# Altium schematic sheet MCU042A_Engine.SchDoc: Engine
size 558 x 431 mm; Date: Not shown in title block; ApprovedBy: Not shown in title block; CheckedBy: Not shown in title block; Author: Not shown in title block; CompanyName: Not shown in title block; DrawnBy: Vince Rodriguez; Engineer: Not shown in title block; Organization: Not shown in title block; Address1: Not shown in title block; Address2: Not shown in title block; Address3: Not shown in title block; Address4: Not shown in title block; DocumentNumber: 2; Revision: Use project parameter SCH_Rev; SheetNumber: 2; SheetTotal: 5; PageSetup: Record=PageOptions|CenterHorizontal=True|CenterVertical=True|PrintScale=1.00|XCorrection=1.00|YCorrection=1.00|PrintKind=0|BorderSize=5000000|LeftOffset=0|BottomOffset=0|Orientation=2|PaperLength=1000|PaperWidth=1000|Scale=100|PaperSource=15|PrintQuality=600|MediaType=1|DitherType=10|PaperKind=Letter|PrintScaleMode=1; CurrentTime: Not shown in title block; CurrentDate: Not shown in title block; Time: Not shown in title block; DocumentFullPathAndName: Not shown in title block; DocumentName: Not shown in title block; ModifiedDate: Not shown in title block; ImagePath: Not shown in title block
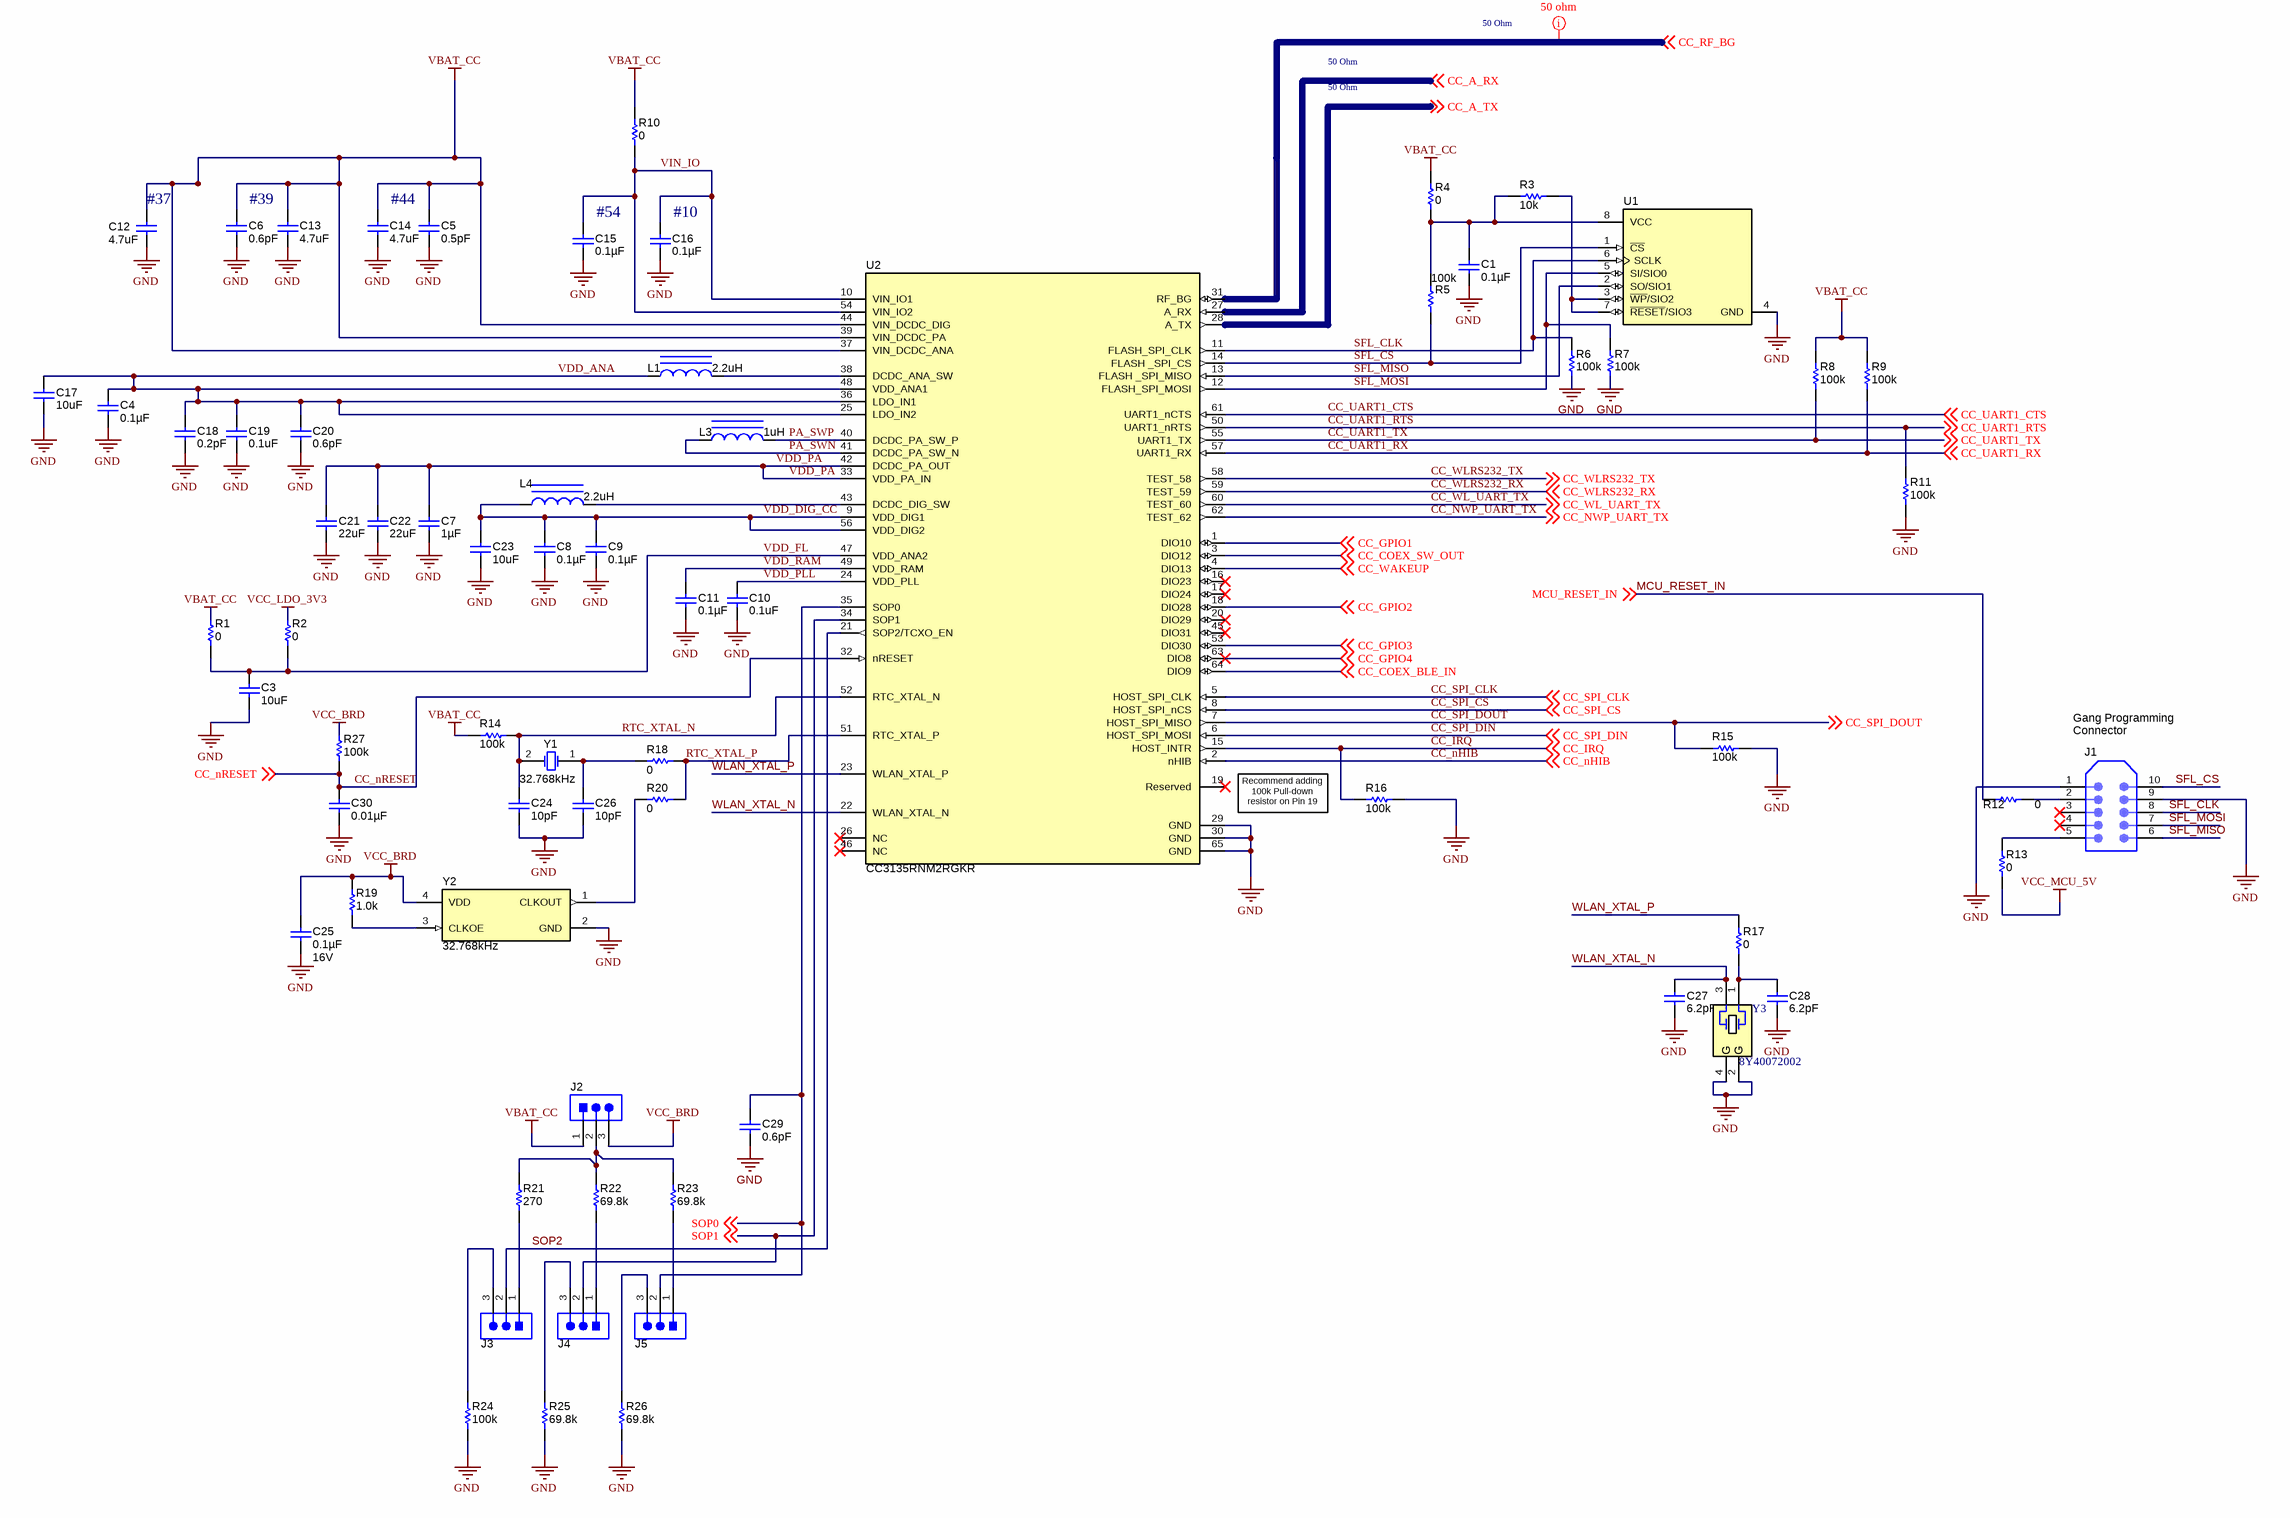
[diagram p0: MCU042A_Engine.SchDoc]

## Parts
C1  ValueDisplayed: 0.1µF  [0402]  (hidden comment: CL05B104KO5NNNC)
C3  ValueDisplayed: 10uF  [0603]  (hidden comment: CMP-0007303-5)
C4  ValueDisplayed: 0.1µF  [0402]  (hidden comment: CL05B104KO5NNNC)
C5  ValueDisplayed: 0.5pF  [0201_033]  (hidden comment: GJM0335C1ER50BB01D)
C6  ValueDisplayed: 0.6pF  [0201_033]  (hidden comment: GJM0335C1ER60BB01D)
C7  ValueDisplayed: 1µF  [0402]  (hidden comment: CL05A105MP5NNNC)
C8  ValueDisplayed: 0.1µF  [0402S]  (hidden comment: CL05B104KO5NNNC)
C9  ValueDisplayed: 0.1µF  [0402S]  (hidden comment: CL05B104KO5NNNC)
C10  ValueDisplayed: 0.1uF  [0201]  (hidden comment: CMP-0009655-3)
C11  ValueDisplayed: 0.1µF  [0402S]  (hidden comment: CL05B104KO5NNNC)
C12  ValueDisplayed: 4.7uF  [0402]  (hidden comment: CMP-0064972-2)
C13  ValueDisplayed: 4.7uF  [0402]  (hidden comment: CMP-0064972-2)
C14  ValueDisplayed: 4.7uF  [0402]  (hidden comment: CMP-0064972-2)
C15  ValueDisplayed: 0.1µF  [0402S]  (hidden comment: CL05B104KO5NNNC)
C16  ValueDisplayed: 0.1µF  [0402S]  (hidden comment: CL05B104KO5NNNC)
C17  ValueDisplayed: 10uF  [0603]  (hidden comment: CMP-0064953-4)
C18  ValueDisplayed: 0.2pF  [0201_033]  (hidden comment: GJM0335C1ER20BB01D)
C19  ValueDisplayed: 0.1uF  [0201]  (hidden comment: CL03A104KP3NNNC)
C20  ValueDisplayed: 0.6pF  [0201_033]  (hidden comment: GJM0335C1ER60BB01D)
C21  ValueDisplayed: 22uF  [0603]  (hidden comment: CMP-0064952-4)
C22  ValueDisplayed: 22uF  [0603]  (hidden comment: CMP-0064952-4)
C23  ValueDisplayed: 10uF  [0603]  (hidden comment: CMP-0064953-4)
C24  ValueDisplayed: 10pF  [0402]  (hidden comment: 0402N100J500CT)
C25  ValueDisplayed: 0.1µF  VDC_V: 16V  [0402]  (hidden comment: CL05B104KO5NNNC)
C26  ValueDisplayed: 10pF  [0402]  (hidden comment: 0402N100J500CT)
C27  ValueDisplayed: 6.2pF  [0402]  (hidden comment: 0402N6R2C500CT)
C28  ValueDisplayed: 6.2pF  [0402]  (hidden comment: 0402N6R2C500CT)
C29  ValueDisplayed: 0.6pF  [0201_033]  (hidden comment: GJM0335C1ER60BB01D)
C30  ValueDisplayed: 0.01µF  [0402]  (hidden comment: 0402B103K500CT)
J1  TC2050-IDC-NL-FP  [Tag_TC2050-NL]  (value not drawn)  (no BOM)
J2  CMP-0054796-1  [WURTH_61300311121]  (value not drawn)
J3  CMP-0054796-1  [WURTH_61300311121]  (value not drawn)
J4  CMP-0054796-1  [WURTH_61300311121]  (value not drawn)
J5  CMP-0054796-1  [WURTH_61300311121]  (value not drawn)
L1  ValueDisplayed: 2.2uH  [LQM2MPN_G0]  (hidden comment: CMP-0058761-1)
L3  ValueDisplayed: 1uH  [1008]  (hidden comment: CMP-0058750-1)
L4  ValueDisplayed: 2.2uH  [LQM2MPN_G0]  (hidden comment: CMP-0058761-1)
R1  ValueDisplayed: 0  [0603]  (hidden comment: CMP-0025885-3)
R2  ValueDisplayed: 0  [0603]  (hidden comment: CMP-0025885-3)
R3  ValueDisplayed: 10k  [0402]  (hidden comment: CMP-0026825-5)
R4  ValueDisplayed: 0  [0603]  (hidden comment: CMP-0025885-3)
R5  ValueDisplayed: 100k  [0402]  (hidden comment: CMP-0026823-3)
R6  ValueDisplayed: 100k  [0402S]  (hidden comment: CMP-0026823-3)
R7  ValueDisplayed: 100k  [0402S]  (hidden comment: CMP-0026823-3)
R8  ValueDisplayed: 100k  [0402]  (hidden comment: CMP-0026823-3)
R9  ValueDisplayed: 100k  [0402]  (hidden comment: CMP-0026823-3)
R10  ValueDisplayed: 0  [0603]  (hidden comment: CMP-0025885-3)
R11  ValueDisplayed: 100k  [0402]  (hidden comment: CMP-0026823-3)
R12  ValueDisplayed: 0  [0402]  (hidden comment: CMP-0026992-2)
R13  ValueDisplayed: 0  [0402]  (hidden comment: CMP-0026992-2)
R14  ValueDisplayed: 100k  [0402]  (hidden comment: CMP-0026823-3)
R15  ValueDisplayed: 100k  [0402]  (hidden comment: CMP-0026823-3)
R16  ValueDisplayed: 100k  [0402]  (hidden comment: CMP-0026823-3)
R17  ValueDisplayed: 0  [0402]  (hidden comment: CMP-0026992-2)
R18  ValueDisplayed: 0  [0402]  (hidden comment: CMP-0026992-2)
R19  ValueDisplayed: 1.0k  [0402]  (hidden comment: CMP-0026852-3)
R20  ValueDisplayed: 0  [0402]  (hidden comment: CMP-0026992-2)
R21  ValueDisplayed: 270  [0402]  (hidden comment: CMP-0026886-3)
R22  ValueDisplayed: 69.8k  [0402]  (hidden comment: CMP-0026510-2)
R23  ValueDisplayed: 69.8k  [0402]  (hidden comment: CMP-0026510-2)
R24  ValueDisplayed: 100k  [0402]  (hidden comment: CMP-0026823-3)
R25  ValueDisplayed: 69.8k  [0402]  (hidden comment: CMP-0026510-2)
R26  ValueDisplayed: 69.8k  [0402]  (hidden comment: CMP-0026510-2)
R27  ValueDisplayed: 100k  [0402]  (hidden comment: CMP-0026823-3)
U1  CMP-0004904-1  [SOP-8_150MIL]  (value not drawn)
U2  CC3135RNM2RGKR  [RGK0064B]
Y1  Frequency_Fixed: 32.768kHz  [XTAL_ABS07]  (hidden comment: CMP-0004575-3)
Y2  Frequency_Fixed: 32.768kHz  [MC_OV-7604-C7]  (hidden comment: CMP-0004716-3)
Y3  8Y40072002  [TXC_8Y]

## Nets
GND: C1.2 C3.2 C4.2 C5.2 C6.2 C7.2 C8.2 C9.2 C10.2 C11.2 C12.2 C13.2 C14.2 C15.2 C16.2 C17.2 C18.2 C19.2 C20.2 C21.2 C22.2 C23.2 C24.2 C25.2 C26.2 C27.2 C28.2 C29.2 C30.2 J1.1 J1.9 R6.1 R7.1 R11.2 R15.2 R16.2 R24.2 R25.2 R26.2 U1.4(GND) U2.29(GND) U2.30(GND) U2.65(GND) Y2.2(GND) Y3.2(GND) Y3.4(GND)
VBAT_CC: C5.1 C6.1 C12.1 C13.1 C14.1 J2.1 R1.2 R4.2 R8.1 R9.1 R10.2 R14.1 U2.37(VIN_DCDC_ANA) U2.39(VIN_DCDC_PA) U2.44(VIN_DCDC_DIG)
VCC_BRD: C25.1 J2.3 R19.1 R27.1 Y2.4(VDD)
VCC_LDO_3V3: R2.2
VCC_MCU_5V: R13.1
CC_A_RX: U2.27(A_RX) ; off-sheet CC_A_RX
CC_A_TX: U2.28(A_TX) ; off-sheet CC_A_TX
CC_COEX_BLE_IN: U2.64(DIO9) ; off-sheet CC_COEX_BLE_IN
CC_COEX_SW_OUT: U2.3(DIO12) ; off-sheet CC_COEX_SW_OUT
CC_GPIO1: U2.1(DIO10) ; off-sheet CC_GPIO1
CC_GPIO2: U2.18(DIO28) ; off-sheet CC_GPIO2
CC_GPIO3: U2.53(DIO30) ; off-sheet CC_GPIO3
CC_GPIO4: U2.63(DIO8) ; off-sheet CC_GPIO4
CC_IRQ: R16.1 U2.15(HOST_INTR) ; off-sheet CC_IRQ
CC_nHIB: U2.2(nHIB) ; off-sheet CC_nHIB
CC_nRESET: C30.1 R27.2 U2.32(nRESET) ; off-sheet CC_nRESET
CC_NWP_UART_TX: U2.62(TEST_62) ; off-sheet CC_NWP_UART_TX
CC_RF_BG: U2.31(RF_BG) ; off-sheet CC_RF_BG
CC_SPI_CLK: U2.5(HOST_SPI_CLK) ; off-sheet CC_SPI_CLK
CC_SPI_CS: U2.8(HOST_SPI_nCS) ; off-sheet CC_SPI_CS
CC_SPI_DIN: U2.6(HOST_SPI_MOSI) ; off-sheet CC_SPI_DIN
CC_SPI_DOUT: R15.1 U2.7(HOST_SPI_MISO) ; off-sheet CC_SPI_DOUT
CC_UART1_CTS: U2.61(UART1_nCTS) ; off-sheet CC_UART1_CTS
CC_UART1_RTS: R11.1 U2.50(UART1_nRTS) ; off-sheet CC_UART1_RTS
CC_UART1_RX: R9.2 U2.57(UART1_RX) ; off-sheet CC_UART1_RX
CC_UART1_TX: R8.2 U2.55(UART1_TX) ; off-sheet CC_UART1_TX
CC_WAKEUP: U2.4(DIO13) ; off-sheet CC_WAKEUP
CC_WL_UART_TX: U2.60(TEST_60) ; off-sheet CC_WL_UART_TX
CC_WLRS232_RX: U2.59(TEST_59) ; off-sheet CC_WLRS232_RX
CC_WLRS232_TX: U2.58(TEST_58) ; off-sheet CC_WLRS232_TX
MCU_RESET_IN: R12.2 ; off-sheet MCU_RESET_IN
PA_SWN: L3.1 U2.41(DCDC_PA_SW_N)
PA_SWP: L3.2 U2.40(DCDC_PA_SW_P)
RTC_XTAL_N: C24.1 R14.2 U2.52(RTC_XTAL_N) Y1.2(OSC2)
RTC_XTAL_P: R18.2 R20.2 U2.51(RTC_XTAL_P)
SFL_CLK: J1.8 R6.2 U1.6(SCLK) U2.11(FLASH_SPI_CLK)
SFL_CS: J1.10 R5.2 U1.1(~{CS}) U2.14(FLASH__SPI_CS)
SFL_MISO: J1.6 U1.2(SO/SIO1) U2.13(FLASH__SPI_MISO)
SFL_MOSI: J1.7 R7.2 U1.5(SI/SIO0) U2.12(FLASH_SPI_MOSI)
SOP0: C29.1 J5.2 U2.35(SOP0) ; off-sheet SOP0
SOP1: J4.2 U2.34(SOP1) ; off-sheet SOP1
SOP2: J3.2 U2.21(SOP2/TCXO_EN)
VDD_ANA: C4.1 C17.1 C18.1 C19.1 C20.1 L1.1 U2.25(LDO_IN2) U2.36(LDO_IN1) U2.48(VDD_ANA1)
VDD_DIG_CC: C8.1 C9.1 C23.1 L4.1 U2.9(VDD_DIG1) U2.56(VDD_DIG2)
VDD_FL: C3.1 R1.1 R2.1 U2.47(VDD_ANA2)
VDD_PA: C7.1 C21.1 C22.1 U2.33(VDD_PA_IN) U2.42(DCDC_PA_OUT)
VDD_PLL: C10.1 U2.24(VDD_PLL)
VDD_RAM: C11.1 U2.49(VDD_RAM)
VIN_IO: C15.1 C16.1 R10.1 U2.10(VIN_IO1) U2.54(VIN_IO2)
WLAN_XTAL_N: C27.1 U2.22(WLAN_XTAL_N) Y3.3
WLAN_XTAL_P: R17.2 U2.23(WLAN_XTAL_P)
NetC1_1: C1.1 R3.1 R4.1 R5.1 U1.8(VCC)
NetC26_1: C26.1 R18.1 Y1.1(OSC1)
NetC28_1: C28.1 R17.1 Y3.1
NetJ1_2: J1.2 R12.1
NetJ1_5: J1.5 R13.2
NetJ2_2: J2.2 R21.1 R22.1 R23.1
NetJ3_1: J3.1 R21.2
NetJ3_3: J3.3 R24.1
NetJ4_1: J4.1 R22.2
NetJ4_3: J4.3 R25.1
NetJ5_1: J5.1 R23.2
NetJ5_3: J5.3 R26.1
NetL1_2: L1.2 U2.38(DCDC_ANA_SW)
NetL4_2: L4.2 U2.43(DCDC_DIG_SW)
NetR3_2: R3.2 U1.3(~{WP}/SIO2) U1.7(~{RESET}/SIO3)
NetR19_2: R19.2 Y2.3(CLKOE)
NetR20_1: R20.1 Y2.1(CLKOUT)

Not connected (* = marked no-connect by the designer): J1 3* 4*; U2 16(DIO23)* 17(DIO24)* 19(Reserved)* 20(DIO29)* 26(NC)* 45(DIO31)* 46(NC)*

## Layout directives
net class 50 ohm: CC_RF_BG

## Notes on the sheet
- 50 Ohm
- (near C12) #37
- #39
- #44
- (near C15) #54
- (near C16) #10
- Gang Programming
  Connector
- Recommend adding 100k Pull-down resistor on Pin 19
- Drawn By:
- SVN Rev:
- Number:
- TID #:
- Orderable:
- Rev:
- Sheet Title:
- File:
- Project Title:
- Designed for:
- Assembly Variant:
- Mod. Date:
- Sheet:
- Size:
- of
- C
- http://www.ti.com
- Texas Instruments and/or its licensors do not warrant the accuracy or completeness of this specification or any information contained therein. Texas Instruments and/or its licensors do not warrant that this design will meet the specifications, will be suitable for your application or fit for any particular purpose, or will operate in an implementation. Texas Instruments and/or its licensors do not warrant that the design is production worthy. You should completely validate and test your design implementation to confirm the system functionality for your application.
- Engineer:
- Contact:
- © Texas Instruments
- (in symbol CMP-0077111-2) G

## Library data of the parts
C1 C4 = CMP-0085850-1: CAP, CERM, 0.1 µF, 16 V,+/- 10%, X7R, 0402; Manufacturer: Walsin; Alternate PartNumber: C1005X5R1A104K050BA; Alternate Manufacturer: TDK; Polarized: N; Value: 0.1uF; U/M: EA; Cap_F: 100nF; VDC_V: 16V; TaMin_C: -55°C; TaMax_C: 125°C; SizeAreaWB_mm2: 3; SizeZ_mm: 0.6; SizeX_mm: 1; SizeY_mm: 0.5; AEC Category: Q200; CompType: Capacitor; PartNumber: CL05B104KO5NNNC; PackageReference: 0402; RoHS: Y; Tolerance_%: 10%; Value2: 16V; MountType: SMT; Technology: Ceramic; TempCo: X7R; Cap_Case: 0402; ComponentLink1Description: Datasheet link; ComponentLink1URL: http://www.samsungsem.com/kr/support/product-search/mlcc/__icsFiles/afieldfile/2018/07/18/CL05B104KO5NNNC.pdf; SizeArea_mm2: 0.5; AEC Qualified: N; AEC Grade: N/A
C3 = CMP-0007303-5: CAP, CERM, 10 uF, 6.3 V, +/- 20%, X5R, 0603; PartNumber: GRM188R60J106ME47D; Manufacturer: MuRata; Alternate PartNumber: CL10A106MQ8NNNC; Alternate Manufacturer: SAMSUNG; Polarized: N; CompType: Capacitor; Value: 10uF; U/M: EA; Cap_F: 10µF; ESR_ohm: 9m; Value1: 0.009 ohm; VDC_V: 6.3V; IRMS_A: 2.74A; TaMin_C: -55°C; TaMax_C: 125°C; SizeAreaWB_mm2: 4.68; SizeZ_mm: 1; SizeX_mm: 1.6; SizeY_mm: 0.8; SizeArea_mm2: 1.28; AEC Category: Q200; PackageReference: 0603; RoHS: Y; Tolerance_%: 20%; Value2: 6.3V; MountType: SMT; Technology: Ceramic; TempCo: X5R; Cap_Case: 0603; Published: 2008-06-19; Publisher: Texas Instruments; LatestRevisionDate: 2017-03-09; ComponentLink1Description: Datasheet link; ComponentLink1URL: http://www.murata.com/products/capacitor/tech_data/pdf/grm188r60j106m.pdf; Supplier 1: Digi-Key; Supplier Part Number 1: 490-3896-1-ND; Supplier 2: Mouser; Supplier Part Number 2: 81-GRM188R60J106ME47; Supplier 3: Farnell; Supplier Part Number 3: 1735528; AEC Qualified: ?
C5 = CMP-0085408-2: CAP, CERM, 0.5 pF, 25 V,+/- 20%, C0G/NP0, 0201; Manufacturer: MuRata; Polarized: N; Value: 0.5pF; U/M: EA; VDC_V: 25V; TaMin_C: -55°C; TaMax_C: 125°C; Cap_Case: 0201; SizeArea_mm2: 0.18; SizeAreaWB_mm2: 2.08; SizeX_mm: 0.6; SizeY_mm: 0.3; SizeZ_mm: 0.33; AEC Category: Q200; CompType: Capacitor; PartNumber: GJM0335C1ER50BB01D; PackageReference: 0201; RoHS: Y; Cap_F: 0.5pF; Tolerance_%: 20%; Value2: 25V; MountType: SMT; Technology: Ceramic; TempCo: C0G/NP0; ComponentLink1Description: Datasheet link; ComponentLink1URL: https://psearch.en.murata.com/capacitor/product/GJM0335C1ER50BB01%23.html; AEC Qualified: N; AEC Grade: N/A
C6 C20 C29 = CMP-0085407-1: CAP, CERM, 0.6pF, 25 V,+/- 16%, C0G/NP0, 0201; Manufacturer: MuRata; Polarized: N; U/M: EA; VDC_V: 25V; TaMin_C: -55°C; TaMax_C: 125°C; Cap_Case: 0201; SizeArea_mm2: 0.18; SizeAreaWB_mm2: 2.08; SizeX_mm: 0.6; SizeY_mm: 0.3; SizeZ_mm: 0.33; AEC Category: Q200; CompType: Capacitor; Value: 0.6pF; PartNumber: GJM0335C1ER60BB01D; PackageReference: 0201; RoHS: Y; Cap_F: 0.6pF; Tolerance_%: 16%; Value2: 25V; MountType: SMT; Technology: Ceramic; TempCo: C0G/NP0; ComponentLink1Description: Datasheet link; ComponentLink1URL: https://psearch.en.murata.com/capacitor/product/GJM0335C1ER60BB01%23.html; AEC Qualified: N; AEC Grade: N/A
C7 = CMP-0085849-1: CAP, CERM, 1 µF, 10 V,+/- 20%, X5R, 0402; Manufacturer: Walsin; Alternate PartNumber: GRM155C81A105KA12D; Alternate Manufacturer: Murata; Polarized: N; Value: 1uF; U/M: EA; VDC_V: 10V; TaMin_C: -55°C; TaMax_C: 85°C; SizeArea_mm2: 0.5; SizeAreaWB_mm2: 3; SizeX_mm: 1; SizeZ_mm: 0.6; AEC Category: Q200; CompType: Capacitor; PartNumber: CL05A105MP5NNNC; PackageReference: 0402; RoHS: Y; Cap_F: 1µF; Tolerance_%: 20%; Value2: 10V; MountType: SMT; Technology: Ceramic; TempCo: X5R; Cap_Case: 0402; ComponentLink1Description: Datasheet link; ComponentLink1URL: http://www.samsungsem.com/kr/support/product-search/mlcc/__icsFiles/afieldfile/2018/06/19/CL05A105MP5NNNC.pdf; SizeY_mm: 0.5; AEC Qualified: N; AEC Grade: N/A
C8 C9 C11 C15 C16 = CMP-0085850-1: CAP, CERM, 0.1 µF, 16 V,+/- 10%, X7R, 0402; Manufacturer: Walsin; Alternate PartNumber: C1005X5R1A104K050BA; Polarized: N; Value: 0.1uF; U/M: EA; Cap_F: 100nF; VDC_V: 16V; TaMin_C: -55°C; TaMax_C: 125°C; Cap_Case: 0402; SizeAreaWB_mm2: 3; SizeZ_mm: 0.6; SizeX_mm: 1; SizeY_mm: 0.5; AEC Category: Q200; CompType: Capacitor; PartNumber: CL05B104KO5NNNC; PackageReference: 0402; RoHS: Y; Tolerance_%: 10%; Value2: 16V; MountType: SMT; Technology: Ceramic; TempCo: X7R; ComponentLink1Description: Datasheet link; ComponentLink1URL: http://www.samsungsem.com/kr/support/product-search/mlcc/__icsFiles/afieldfile/2018/07/18/CL05B104KO5NNNC.pdf; SizeArea_mm2: 0.5; AEC Qualified: N; AEC Grade: N/A
C10 = CMP-0009655-3: CAP, CERM, 0.1 uF, 10 V, +/- 10%, X5R, 0201; PartNumber: CL03A104KP3NNNC; Manufacturer: Samsung Electro-Mechanics; Polarized: N; Value: 0.1uF; U/M: EA; Cap_F: 100nF; Value1: Unknown; VDC_V: 10V; TaMin_C: -55°C; TaMax_C: 85°C; SizeArea_mm2: 0.18; SizeAreaWB_mm2: 2.08; SizeX_mm: 0.6; SizeY_mm: 0.3; SizeZ_mm: 0.26; AEC Category: Q200; CompType: Capacitor; PackageReference: 0201; RoHS: Y; Tolerance_%: 10%; Value2: 10V; MountType: SMT; Technology: Ceramic; TempCo: X5R; Cap_Case: 0201; Published: 2008-06-19; Publisher: Texas Instruments; LatestRevisionDate: 2017-03-09; ComponentLink1Description: Datasheet link; ComponentLink1URL: http://www.samsungsem.com/servlet/FileDownload?type=spec&file=CL03A104KP3NNNC.pdf; AEC Qualified: ?
C12-C14 = CMP-0064972-2: CAP, CERM, 4.7 uF, 6.3 V,+/- 20%, X6S, 0402; PartNumber: JMK105BC6475MV-F; Manufacturer: Taiyo Yuden; Alternate PartNumber: CL05A475MQ5NRNC; Alternate Manufacturer: SAMSUNG; Polarized: N; CompType: Capacitor; Value: 4.7uF; U/M: EA; Cap_F: 4.7µF; Value1: Unknown; VDC_V: 6.3V; TaMin_C: -55°C; TaMax_C: 105°C; SizeArea_mm2: 0.5; SizeAreaWB_mm2: 3; SizeX_mm: 1; SizeZ_mm: 0.6; AEC Category: Q200; PackageReference: 0402; RoHS: Y; Tolerance_%: 20%; Value2: 6.3V; MountType: SMT; Technology: Ceramic; TempCo: X6S; Cap_Case: 0402; Published: 2008-06-19; Publisher: Texas Instruments; LatestRevisionDate: 2017-06-05; ComponentLink1Description: Datasheet link; ComponentLink1URL: http://ds.yuden.co.jp/TYCOMPAS/ut/detail.do?productNo=JMK105BC6475MV-F&dataUnit=M; Supplier 1: Newark; Supplier Part Number 1: 48Y4404; Supplier 2: Mouser; Supplier Part Number 2: 963-JMK105BC6475MV-F; SizeY_mm: 0.5; AEC Qualified: N; AEC Grade: N/A
C17 C23 = CMP-0064953-4: CAP, CERM, 10 uF, 10 V,+/- 20%, X6S, 0603; PartNumber: LMK107BC6106MA-T; Manufacturer: Taiyo Yuden; Alternate PartNumber: CL10A106MP8NNNC; Alternate Manufacturer: SAMSUNG; Polarized: N; CompType: Capacitor; Value: 10uF; U/M: EA; Cap_F: 10µF; Value1: Unknown; VDC_V: 10V; TaMin_C: -55°C; TaMax_C: 105°C; SizeArea_mm2: 1.28; SizeAreaWB_mm2: 4.68; SizeX_mm: 1.6; SizeY_mm: 0.8; SizeZ_mm: 1; AEC Category: Q200; PackageReference: 0603; RoHS: Y; Tolerance_%: 20%; Value2: 10V; MountType: SMT; Technology: Ceramic; TempCo: X6S; Cap_Case: 0603; Published: 2008-06-19; Publisher: Texas Instruments; LatestRevisionDate: 2017-06-05; ComponentLink1Description: Datasheet link; ComponentLink1URL: http://ds.yuden.co.jp/TYCOMPAS/ut/detail.do?productNo=LMK107BC6106MA-T&dataUnit=M; Supplier 1: Newark; Supplier Part Number 1: 95Y1652; Supplier 2: Mouser; Supplier Part Number 2: 963-LMK107BC6106MA-T; AEC Qualified: N; AEC Grade: N/A
C18 = CMP-0085602-1: CAP, CERM, 0.2pF, 25 V,+/- 50%, C0G/NP0, 0201; Manufacturer: MuRata; Polarized: N; U/M: EA; VDC_V: 25V; TaMin_C: -55°C; TaMax_C: 125°C; Cap_Case: 0201; SizeArea_mm2: 0.18; SizeAreaWB_mm2: 2.08; SizeX_mm: 0.6; SizeY_mm: 0.3; SizeZ_mm: 0.33; AEC Category: Q200; CompType: Capacitor; Value: 0.2pF; PartNumber: GJM0335C1ER20BB01D; PackageReference: 0201; RoHS: Y; Cap_F: 0.2pF; Tolerance_%: 50%; Value2: 25V; MountType: SMT; Technology: Ceramic; TempCo: C0G/NP0; ComponentLink1Description: Datasheet link; ComponentLink1URL: https://psearch.en.murata.com/capacitor/product/GJM0335C1ER20BB01%23.html; AEC Qualified: N; AEC Grade: N/A
C19 = CMP-0009655-3: CAP, CERM, 0.1 uF, 10 V, +/- 10%, X5R, 0201; Manufacturer: Samsung Electro-Mechanics; Polarized: N; Value: 0.1uF; U/M: EA; Cap_F: 100nF; Value1: Unknown; VDC_V: 10V; TaMin_C: -55°C; TaMax_C: 85°C; SizeArea_mm2: 0.18; SizeAreaWB_mm2: 2.08; SizeX_mm: 0.6; SizeY_mm: 0.3; SizeZ_mm: 0.26; AEC Category: Q200; CompType: Capacitor; PartNumber: CL03A104KP3NNNC; PackageReference: 0201; RoHS: Y; Tolerance_%: 10%; Value2: 10V; MountType: SMT; Technology: Ceramic; TempCo: X5R; Cap_Case: 0201; ComponentLink1Description: Datasheet link; ComponentLink1URL: http://www.samsungsem.com/servlet/FileDownload?type=spec&file=CL03A104KP3NNNC.pdf; AEC Qualified: ?; Publisher: Texas Instruments; Published: 2008-06-19; LatestRevisionDate: 2017-03-09
C21 C22 = CMP-0064952-4: CAP, CERM, 22 uF, 4 V,+/- 20%, X6S, 0603; PartNumber: GRM188C80G226ME15J; Manufacturer: MuRata; Alternate PartNumber: CL10A226MQ8NRNC; Alternate Manufacturer: SAMSUNG; Polarized: N; CompType: Capacitor; Value: 22uF; U/M: EA; Cap_F: 22µF; Value1: Unknown; VDC_V: 4V; TaMin_C: -55°C; TaMax_C: 105°C; SizeArea_mm2: 1.28; SizeAreaWB_mm2: 4.68; SizeX_mm: 1.6; SizeY_mm: 0.8; SizeZ_mm: 1; AEC Category: Q200; PackageReference: 0603; RoHS: Y; Tolerance_%: 20%; Value2: 4V; MountType: SMT; Technology: Ceramic; TempCo: X6S; Cap_Case: 0603; Published: 2008-06-19; Publisher: Texas Instruments; LatestRevisionDate: 2017-06-05; ComponentLink1Description: Datasheet link; ComponentLink1URL: http://search.murata.co.jp/Ceramy/image/img/A01X/G101/ENG/GRM188C80G226ME15-01.pdf; Supplier 1: Mouser; Supplier Part Number 1: 81-GRM188C80G226ME5J; AEC Qualified: N; AEC Grade: N/A
C24 C26 = CMP-0085843-1: CAP, CERM, 10 pF, 50 V,+/- 5%, C0G/NP0, 0402; Manufacturer: Walsin; Alternate PartNumber: GRM1555C1H100JA01D; Alternate Manufacturer: Murata; Polarized: N; Value: 10pF; U/M: EA; VDC_V: 50V; TaMin_C: -55°C; TaMax_C: 125°C; SizeArea_mm2: 0.5; SizeAreaWB_mm2: 3; SizeX_mm: 1; SizeZ_mm: 0.6; AEC Category: Q200; CompType: Capacitor; PartNumber: 0402N100J500CT; PackageReference: 0402; RoHS: Y; Cap_F: 10pF; Tolerance_%: 5%; Value2: 50V; MountType: SMT; Technology: Ceramic; TempCo: C0G/NP0; Cap_Case: 0402; ComponentLink1Description: Datasheet link; ComponentLink1URL: http://www.passivecomponent.com/indexsea/0402N100J500CT-IN.pdf; SizeY_mm: 0.5; AEC Qualified: N; AEC Grade: N/A
C25 = CMP-0085850-1: CAP, CERM, 0.1 µF, 16 V,+/- 10%, X7R, 0402; Manufacturer: Walsin; Polarized: N; Value: 0.1uF; U/M: EA; Cap_F: 100nF; TaMin_C: -55°C; TaMax_C: 125°C; SizeAreaWB_mm2: 3; SizeZ_mm: 0.6; SizeX_mm: 1; SizeY_mm: 0.5; AEC Category: Q200; CompType: Capacitor; PartNumber: CL05B104KO5NNNC; PackageReference: 0402; RoHS: Y; Tolerance_%: 10%; Value2: 16V; MountType: SMT; Technology: Ceramic; TempCo: X7R; Cap_Case: 0402; ComponentLink1Description: Datasheet link; ComponentLink1URL: http://www.samsungsem.com/kr/support/product-search/mlcc/__icsFiles/afieldfile/2018/07/18/CL05B104KO5NNNC.pdf; SizeArea_mm2: 0.5; AEC Qualified: N; AEC Grade: N/A
C27 C28 = CMP-0085844-1: CAP, CERM, 6.2 pF, 50 V,+/- 4%, C0G/NP0, 0402; Manufacturer: Walsin; Alternate PartNumber: GRM1555C1H6R2CA1D; Polarized: N; Value: 6.2pF; U/M: EA; VDC_V: 50V; TaMin_C: -55°C; TaMax_C: 125°C; SizeAreaWB_mm2: 3; SizeZ_mm: 0.6; SizeX_mm: 1; SizeY_mm: 0.5; AEC Category: Q200; CompType: Capacitor; PartNumber: 0402N6R2C500CT; PackageReference: 0402; RoHS: Y; Cap_F: 6.2pF; Tolerance_%: 4%; Value2: 50V; MountType: SMT; Technology: Ceramic; TempCo: C0G/NP0; Cap_Case: 0402; ComponentLink1Description: Datasheet link; ComponentLink1URL: http://www.passivecomponent.com/indexsea/0402N6R2C500CT-IN.pdf; SizeArea_mm2: 0.5; AEC Qualified: N; AEC Grade: N/A
C30 = CMP-0085842-1: CAP, CERM, 0.01 µF, 50 V,+/- 10%, X7R, 0402; Manufacturer: Walsin; Alternate PartNumber: GRM155R71E103KA01D; Polarized: N; Value: 0.01uF; U/M: EA; Cap_F: 10nF; VDC_V: 50V; TaMin_C: -55°C; TaMax_C: 125°C; SizeArea_mm2: 0.5; SizeAreaWB_mm2: 3; SizeX_mm: 1; SizeZ_mm: 0.6; AEC Category: Q200; CompType: Capacitor; PartNumber: 0402B103K500CT; PackageReference: 0402; RoHS: Y; Tolerance_%: 10%; Value2: 50V; MountType: SMT; Technology: Ceramic; TempCo: X7R; Cap_Case: 0402; ComponentLink1Description: Datasheet link; ComponentLink1URL: http://www.passivecomponent.com/indexsea/0402B103K500CT-IN.pdf; SizeY_mm: 0.5; AEC Qualified: N; AEC Grade: N/A
J1 = CMP-0075101-1: Footprint for Tag-Connect TC2050 No-Legs cables; CompType: Receptacle; Note: Footprint only, to mate with Tag-Connect TC2050 No-Legs cables; CT: False; PartNumber: TC2050-IDC-NL-FP; Manufacturer: Tag-Connect; PackageReference: Footprint for TC2050 No Legs series of cables; MountType: N/A; ComponentLink1Description: Datasheet URL; ComponentLink1URL: http://www.tag-connect.com/Materials/TC2050-IDC-430-NL%20Datasheet.pdf; Publisher: Texas Instruments; LatestRevisionDate: 2017-07-12; CNHeader: False
J2-J5 = CMP-0054796-1: Header, 2.54 mm, 3x1, Gold, TH; PartNumber: 61300311121; Manufacturer: Wurth Elektronik; Alternate Manufacturer: ----; CNHeader: TRUE; Green_Lifecycle: Active; Green_REACh: Passed; CT: FALSE; PackageReference: Header, 2.54mm, 3x1, TH; ClassName: Header; CompType: Header; RoHS: Y; MountType: TH; ComponentLink1Description: Datasheet URL; ComponentLink1URL: http://katalog.we-online.de/em/datasheet/6130xx11121.pdf; Publisher: Texas Instruments; LatestRevisionDate: 26/05/2017; Alternate PartNumber: ----; Supplier 1: Digi-Key; Supplier Part Number 1: 732-5316-ND; Supplier 2: Newark; Supplier Part Number 2: 20X0950; Supplier 3: Farnell; Supplier Part Number 3: 356154; Green_EU RoHS-2: Incomplete; Green_EU RoHS: Passed
L1 L4 = CMP-0058761-1: Inductor, Multilayer, Ferrite, 2.2 uH, 1.2 A, 0.11 ohm, SMD; PartNumber: LQM2MPN2R2NG0; Manufacturer: MuRata; Alternate PartNumber: ----; Value: 2.2uH; Ind_H: 2.2µH; Imax_A: 1.2A; Irms: 1.2A @ 40C rise; DCR_ohm: 1.1d; SizeAreaWB_mm2: 7.8; SizeArea_mm2: 3.2; SizeX_mm: 2; SizeY_mm: 1.6; SizeZ_mm: 1; AEC Category: Q200; AEC Qualified: N; CompType: Inductor; Value1: 0.11 ohm; Value2: 1.2A; Technology: Multilayer; MountType: SMT; Material: Ferrite; PackageReference: 2.0x1.6mm; Published: 2008-06-26; Publisher: Texas Instruments; LatestRevisionDate: 2017-06-02; ComponentLink1Description: Datasheet link; ComponentLink1URL: http://www.murata.com/~/media/webrenewal/support/library/catalog/products/inductor/chip/o05e.ashx; RoHS: Y; Alternate Manufacturer: ----; Supplier 1: Digi-Key; Supplier Part Number 1: 490-7786-1-ND; Supplier 2: Newark; Supplier Part Number 2: 45Y5442; Supplier 3: Mouser; Supplier Part Number 3: 81-LQM2MPN2R2NG0L; AEC Grade: N/A
L3 = CMP-0058750-1: Inductor, Multilayer, Ferrite, 1 uH, 1.6 A, 0.055 ohm, SMD; PartNumber: LQM2HPN1R0MG0L; Manufacturer: MuRata; Alternate PartNumber: ----; Value: 1uH; Ind_H: 1µH; Imax_A: 1.6A; Irms: 1.6A @ 40C rise; DCR_ohm: 0.055; Green_Lifecycle: Active; SizeAreaWB_mm2: 10.5; Green_REACh: Passed; SizeZ_mm: 1.2; SizeX_mm: 2.5; SizeY_mm: 2; SizeArea_mm2: 5; AEC Category: Q200; CompType: Inductor; Value1: 0.055 ohm; Value2: 1.6A; Technology: Multilayer; MountType: SMT; Material: Ferrite; PackageReference: SMD, Body 2.5x2mm, Height 1.2mm; Published: 2008-06-26; Publisher: Texas Instruments; LatestRevisionDate: 2017-06-02; ComponentLink1Description: Datasheet link; ComponentLink1URL: http://psearch.murata.com/inductor/product/LQM2HPN1R0MG0%23.pdf; RoHS: Y; Alternate Manufacturer: ----; Supplier 1: Digi-Key; Supplier Part Number 1: 490-5112-1-ND; Supplier 2: Mouser; Supplier Part Number 2: 81-LQM2HPN1R0MG0L; Green_EU RoHS-2: Incomplete; Green_EU RoHS: Passed; AEC Qualified: ?
R1 R2 R4 R10 = CMP-0025885-3: RES, 0, 5%, 0.1 W, 0603; PartNumber: RC0603JR-070RL; Manufacturer: Yageo America; Alternate Manufacturer: ----; Value: 0; Value_Code: 0000; Power_W: 100mW; Value2: 0.1W; VDC_V: 50V; TempCo: 200 ppm/C; EIA_Code: E24; U/M: EA; SizeX_mm: 1.6; SizeZ_mm: 1; SizeArea_mm2: 1.28; AEC Category: Q200; SizeY_mm: 0.8; CompType: Resistor; PackageReference: 0603; RoHS: Y; Res_ohm: 0; Tolerance_%: 5%; Value1: 5%; MountType: SMT; Technology: Thick Film; Published: 2008-06-26; Publisher: Texas Instruments; LatestRevisionDate: 2017-03-09; ComponentLink1Description: Datasheet link; ComponentLink1URL: http://www.yageo.com/pdf/Pu-RC0603_51_PbFree_L_2.pdf; Alternate PartNumber: ----; Supplier 1: Digi-Key; Supplier Part Number 1: 311-0.0GRCT-ND; Supplier 2: Mouser; Supplier Part Number 2: 603-RC0603JR-070RL; Supplier 3: Farnell; Supplier Part Number 3: 9233130; AEC Qualified: ?
R3 = CMP-0026825-5: RES, 10 k, 5%, 0.063 W, AEC-Q200 Grade 0, 0402; PartNumber: CRCW040210K0JNED; Manufacturer: Vishay-Dale; Alternate Manufacturer: YAGEO; Alternate PartNumber: RC0402JR-0710KL; Value: 10k; Value_Code: 10k0; Power_W: 63mW; Value2: 0.063W; VDC_V: 50V; TempCo: 200 ppm/C; EIA_Code: E24; SizeX_mm: 1; SizeY_mm: 0.5; SizeZ_mm: 0.6; AEC Qualified: Y; AEC Category: Q200; AEC Grade: 0; CompType: Resistor; PackageReference: 0402; RoHS: E; Res_ohm: 10k; Tolerance_%: 5%; Value1: 5%; MountType: SMT; Technology: Thick Film; ComponentLink1Description: Datasheet link; ComponentLink1URL: http://www.vishay.com/docs/20035/dcrcwe3.pdf; Supplier 1: Digi-Key; Supplier Part Number 1: 541-10KJCT-ND; Supplier 2: Newark; Supplier Part Number 2: 59M6696; Supplier 3: Mouser; Supplier Part Number 3: 71-CRCW0402J-10K-E3; SizeArea_mm2: 0.5
R5 R8 R9 R11 R14-R16 R24 R27 = CMP-0026823-3: RES, 100 k, 5%, 0.063 W, AEC-Q200 Grade 0, 0402; PartNumber: CRCW0402100KJNED; Manufacturer: Vishay-Dale; Alternate Manufacturer: YAGEO; Alternate PartNumber: RC0402JR-07100KL; Value: 100k; Power_W: 63mW; Value2: 0.063W; VDC_V: 50V; TempCo: 200 ppm/C; EIA_Code: E24; SizeX_mm: 1; SizeY_mm: 0.5; SizeZ_mm: 0.6; AEC Qualified: Y; AEC Category: Q200; AEC Grade: 0; CompType: Resistor; PackageReference: 0402; RoHS: E; Res_ohm: 100k; Value_Code: 100k; Tolerance_%: 5%; Value1: 5%; MountType: SMT; Technology: Thick Film; ComponentLink1Description: Datasheet link; ComponentLink1URL: http://www.vishay.com/docs/20035/dcrcwe3.pdf; Supplier 1: Digi-Key; Supplier Part Number 1: 541-100KJCT-ND; Supplier 2: Newark; Supplier Part Number 2: 59M6699; Supplier 3: Mouser; Supplier Part Number 3: 71-CRCW0402J-100K-E3; SizeArea_mm2: 0.5
R6 R7 = CMP-0026823-3: RES, 100 k, 5%, 0.063 W, AEC-Q200 Grade 0, 0402; PartNumber: CRCW0402100KJNED; Manufacturer: Vishay-Dale; Alternate Manufacturer: YAGEO; Alternate PartNumber: RC0402JR-07100KL; CompType: Resistor; Value: 100k; Power_W: 63mW; Value2: 0.063W; VDC_V: 50V; TempCo: 200 ppm/C; SizeArea_mm2: 0.5; SizeX_mm: 1; SizeZ_mm: 0.6; EIA_Code: E24; AEC Category: Q200; AEC Qualified: Y; AEC Grade: 0; PackageReference: 0402; RoHS: E; Res_ohm: 100k; Value_Code: 100k; Tolerance_%: 5%; Value1: 5%; MountType: SMT; Technology: Thick Film; SizeY_mm: 0.5; ComponentLink1Description: Datasheet link; ComponentLink1URL: http://www.vishay.com/docs/20035/dcrcwe3.pdf; Supplier 1: Digi-Key; Supplier Part Number 1: 541-100KJCT-ND; Supplier 2: Newark; Supplier Part Number 2: 59M6699; Supplier 3: Mouser; Supplier Part Number 3: 71-CRCW0402J-100K-E3
R12 R13 R17 R18 R20 = CMP-0026992-2: RES, 0, 5%, 0.063 W, 0402; PartNumber: ERJ-2GE0R00X; Manufacturer: Panasonic; Alternate Manufacturer: YAGEO; Alternate PartNumber: RC0402JR-070RL; Value: 0; Value_Code: 0000; Power_W: 63mW; Value2: 0.063W; VDC_V: 50V; TempCo: 600 ppm/C; EIA_Code: E24; U/M: EA; SizeX_mm: 1; SizeY_mm: 0.5; SizeZ_mm: 0.6; AEC Category: Q200; CompType: Resistor; PackageReference: 0402; RoHS: Y; Res_ohm: 0; Tolerance_%: 5%; Value1: 5%; MountType: SMT; Technology: Thick Film; Published: 2008-06-26; Publisher: Texas Instruments; LatestRevisionDate: 2017-03-09; ComponentLink1Description: Datasheet link; ComponentLink1URL: http://www.panasonic.com/industrial/components/pdf/AOA0000CE1.pdf; Supplier 1: Digi-Key; Supplier Part Number 1: P0.0JCT-ND; Supplier 2: Newark; Supplier Part Number 2: 65T8307; Supplier 3: Mouser; Supplier Part Number 3: 667-ERJ-2GE0R00X; SizeArea_mm2: 0.5; AEC Qualified: ?
R19 = CMP-0026852-3: RES, 1.0 k, 5%, 0.063 W, AEC-Q200 Grade 0, 0402; PartNumber: CRCW04021K00JNED; Manufacturer: Vishay-Dale; Alternate Manufacturer: YAGEO; Alternate PartNumber: RC0402JR-071KL; CompType: Resistor; Value: 1.0k; Res_ohm: 1k; Value_Code: 1k00; Power_W: 63mW; Value2: 0.063W; VDC_V: 50V; TempCo: 200 ppm/C; EIA_Code: E24; SizeX_mm: 1; SizeY_mm: 0.5; SizeZ_mm: 0.6; AEC Qualified: Y; AEC Category: Q200; AEC Grade: 0; PackageReference: 0402; RoHS: E; Tolerance_%: 5%; Value1: 5%; MountType: SMT; Technology: Thick Film; ComponentLink1Description: Datasheet link; ComponentLink1URL: http://www.vishay.com/docs/20035/dcrcwe3.pdf; Supplier 1: Digi-Key; Supplier Part Number 1: 541-1.0KJCT-ND; Supplier 2: Newark; Supplier Part Number 2: 59M6691; Supplier 3: Mouser; Supplier Part Number 3: 71-CRCW0402J-1.0K-E3; SizeArea_mm2: 0.5
R21 = CMP-0026886-3: RES, 270, 5%, 0.063 W, AEC-Q200 Grade 0, 0402; PartNumber: CRCW0402270RJNED; Manufacturer: Vishay-Dale; Alternate Manufacturer: YAGEO; Alternate PartNumber: RC0402JR-07270RL; CompType: Resistor; Value: 270; Value_Code: 270R; Power_W: 63mW; Value2: 0.063W; VDC_V: 50V; TempCo: 200 ppm/C; EIA_Code: E24; SizeX_mm: 1; SizeY_mm: 0.5; SizeZ_mm: 0.6; AEC Qualified: Y; AEC Category: Q200; AEC Grade: 0; PackageReference: 0402; RoHS: E; Res_ohm: 270; Tolerance_%: 5%; Value1: 5%; MountType: SMT; Technology: Thick Film; ComponentLink1Description: Datasheet link; ComponentLink1URL: http://www.vishay.com/docs/20035/dcrcwe3.pdf; Supplier 1: Digi-Key; Supplier Part Number 1: 541-270JCT-ND; Supplier 2: Newark; Supplier Part Number 2: 59M6722; Supplier 3: Mouser; Supplier Part Number 3: 71-CRCW0402J-270-E3; SizeArea_mm2: 0.5
R22 R23 R25 R26 = CMP-0026510-2: RES, 69.8 k, 1%, 0.063 W, AEC-Q200 Grade 0, 0402; PartNumber: CRCW040269K8FKED; Manufacturer: Vishay-Dale; Alternate Manufacturer: YAGEO; Alternate PartNumber: RC0402FR-0769K8L; Value: 69.8k; Value_Code: 69k8; Power_W: 63mW; Value2: 0.063W; VDC_V: 50V; TempCo: 100 ppm/C; SizeArea_mm2: 0.5; SizeX_mm: 1; SizeZ_mm: 0.6; EIA_Code: E96; AEC Category: Q200; AEC Qualified: Y; AEC Grade: 0; CompType: Resistor; PackageReference: 0402; RoHS: E; Res_ohm: 69.8k; Tolerance_%: 1%; Value1: 1%; MountType: SMT; Technology: Thick Film; SizeY_mm: 0.5; ComponentLink1Description: Datasheet link; ComponentLink1URL: http://www.vishay.com/docs/20035/dcrcwe3.pdf; Supplier 1: Digi-Key; Supplier Part Number 1: 541-69.8KLCT-ND; Supplier 2: Newark; Supplier Part Number 2: 52K7233; Supplier 3: Mouser; Supplier Part Number 3: 71-CRCW0402-69.8K-E3
U1 = CMP-0004904-1: ULTRA LOW POWER, 16M-BIT [x 1/x 2/x 4] CMOS MXSMIO(SERIAL MULTI I/O) FLASH MEMORY, SOP-8; PartNumber: MX25R1635FM1IL0; Manufacturer: Macronix International Co., LTD; Alternate Manufacturer: ----; MountType: SMT; ComponentLink1Description: Datasheet URL; ComponentLink1URL: http://www.macronix.com/Lists/Datasheet/Attachments/3270/MX25R1635F,%20Wide%20Range,%2016Mb,%20v1.2.pdf; RoHS: Y; PackageReference: 8-SOP; Publisher: Texas Instruments; LatestRevisionDate: 09/03/2017; Alternate PartNumber: ----
U2 = CMP-0079887-6: CC3135, RGK0064B (VQFN-64); Alternate PartNumber: CC3135RNM2RGKT; Manufacturer: Texas Instruments; AEC Category: Q200; CompType: IC; SizeY_mm: 9.0; SizeAreaWB_mm2: 121.0; AEC Qualified: N; SizeZ_mm: 1.0; SizeArea_mm2: 81.0; ComponentLink1Description: Datasheet Link; ComponentLink3URL: http://www.ti.com/product/cc3135/datasheet; ComponentLink2Description: Product Folder; PackageReference: RGK0064B; SizeX_mm: 9.0; ComponentLink2URL: http://www.ti.com/product/cc3135; PackageDescription: VQFN-64; ComponentLink1URL: http://www.ti.com/lit/ds/symlink/cc3220.pdf; Alternate Manufacturer: Texas Instruments; PartNumber: CC3135RNM2RGKR; MountType: SMT; ComponentLink3Description: Online Datasheet
Y1 = CMP-0004575-3: CRYSTAL, 32.768KHz, 9PF, SMD; PartNumber: ABS07-32.768KHZ-9-T; Manufacturer: Abracon Corporation; Alternate Manufacturer: ----; TaMin_C: -40°C; TaMax_C: 85°C; Frequency Stability: +/-20ppm; CompType: Crystal; PackageReference: 3.2x0.9x1.5mm; MountType: SMT; RoHS: Y; ComponentLink1Description: Datasheet Link; ComponentLink1URL: http://www.abracon.com/Resonators/ABS07.pdf; Alternate PartNumber: ----; Supplier 1: Digi-Key; Supplier Part Number 1: 535-9544-1-ND; Supplier 2: Newark; Supplier Part Number 2: 14N8751; Supplier 3: Mouser; Supplier Part Number 3: 815-ABS07-32.768K9T; REACh: Y
Y2 = CMP-0004716-3: Low Power Clock Oscillator, 32.768 kHz, SMD; PartNumber: OV-7604-C7; Manufacturer: Micro Crystal AG; Alternate Manufacturer: ----; TaMin_C: -40°C; TaMax_C: 85°C; CompType: Oscillator; PackageReference: OSC, 1.5x1x3.2mm; MountType: SMT; RoHS: Y; ComponentLink1Description: Datasheet Link; ComponentLink1URL: http://www.microcrystal.com/images/_PDF/4_Low-power-Oscillator_OV-WM/ov-7604-c7.pdf; Alternate PartNumber: ----; Supplier 1: Newark; Supplier Part Number 1: 94M8600; Supplier 2: Farnell; Supplier Part Number 2: 1539387
Y3 = CMP-0077111-2: Crystal, 40 MHz, 8 pF, SMD; Manufacturer: TXC Corporation; Alternate Manufacturer: ----; Alternate PartNumber: Direct from MFR; U/M: EA; TaMin_C: -40°C; TaMax_C: 95°C; Frequency Stability: ±15ppm; Frequency_Fixed: 40MHz; PartNumber: 8Y40072002; CompType: Crystal; PackageReference: 2x1.6mm; MountType: SMT; RoHS: Y; ComponentLink1Description: Datasheet Link; ComponentLink1URL: https://sps16.itg.ti.com/sites/KMS/crossdivteams/altium/docs/ComponentDatasheets/8Y40072002 TI.pdf; Publisher: Texas Instruments; LatestRevisionDate: 2017-07-31